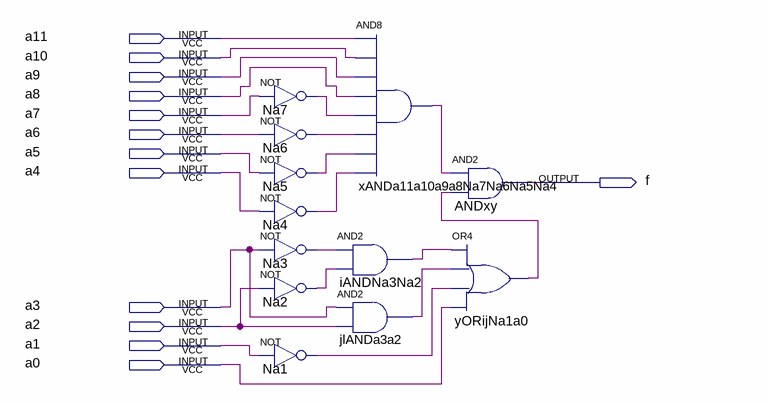
[diagram p0: schematic sheet]
// Quartus schematic Lab3.bdf as structural Verilog: 12 symbols, 13 pins
module Lab3 (
  input  a11,
  input  a10,
  input  a9,
  input  a8,
  input  a7,
  input  a6,
  input  a5,
  input  a4,
  input  a3,
  input  a2,
  input  a1,
  input  a0,
  output f
);

  wire iANDNa3Na2_out, jlANDa3a2_out, Na1_out, Na2_out, Na3_out, Na4_out, Na5_out, Na6_out, Na7_out,
       xANDa11a10a9a8Na7Na6Na5Na4_out, yORijNa1a0_out;

  not Na7 (Na7_out, a7);
  not Na6 (Na6_out, a6);
  not Na5 (Na5_out, a5);
  not Na4 (Na4_out, a4);
  not Na3 (Na3_out, a3);
  not Na2 (Na2_out, a2);
  not Na1 (Na1_out, a1);
  and xANDa11a10a9a8Na7Na6Na5Na4 (xANDa11a10a9a8Na7Na6Na5Na4_out, a11, a10, a9, a8, Na7_out, Na6_out, Na5_out, Na4_out);
  and iANDNa3Na2 (iANDNa3Na2_out, Na3_out, Na2_out);
  and jlANDa3a2 (jlANDa3a2_out, a3, a2);
  and ANDxy (f, xANDa11a10a9a8Na7Na6Na5Na4_out, yORijNa1a0_out);
  or yORijNa1a0 (yORijNa1a0_out, iANDNa3Na2_out, jlANDa3a2_out, Na1_out, a0);
endmodule
